# Altium schematic sheet Top Level.SchDoc
size A3; SheetNumber: 1; SheetTotal: 5
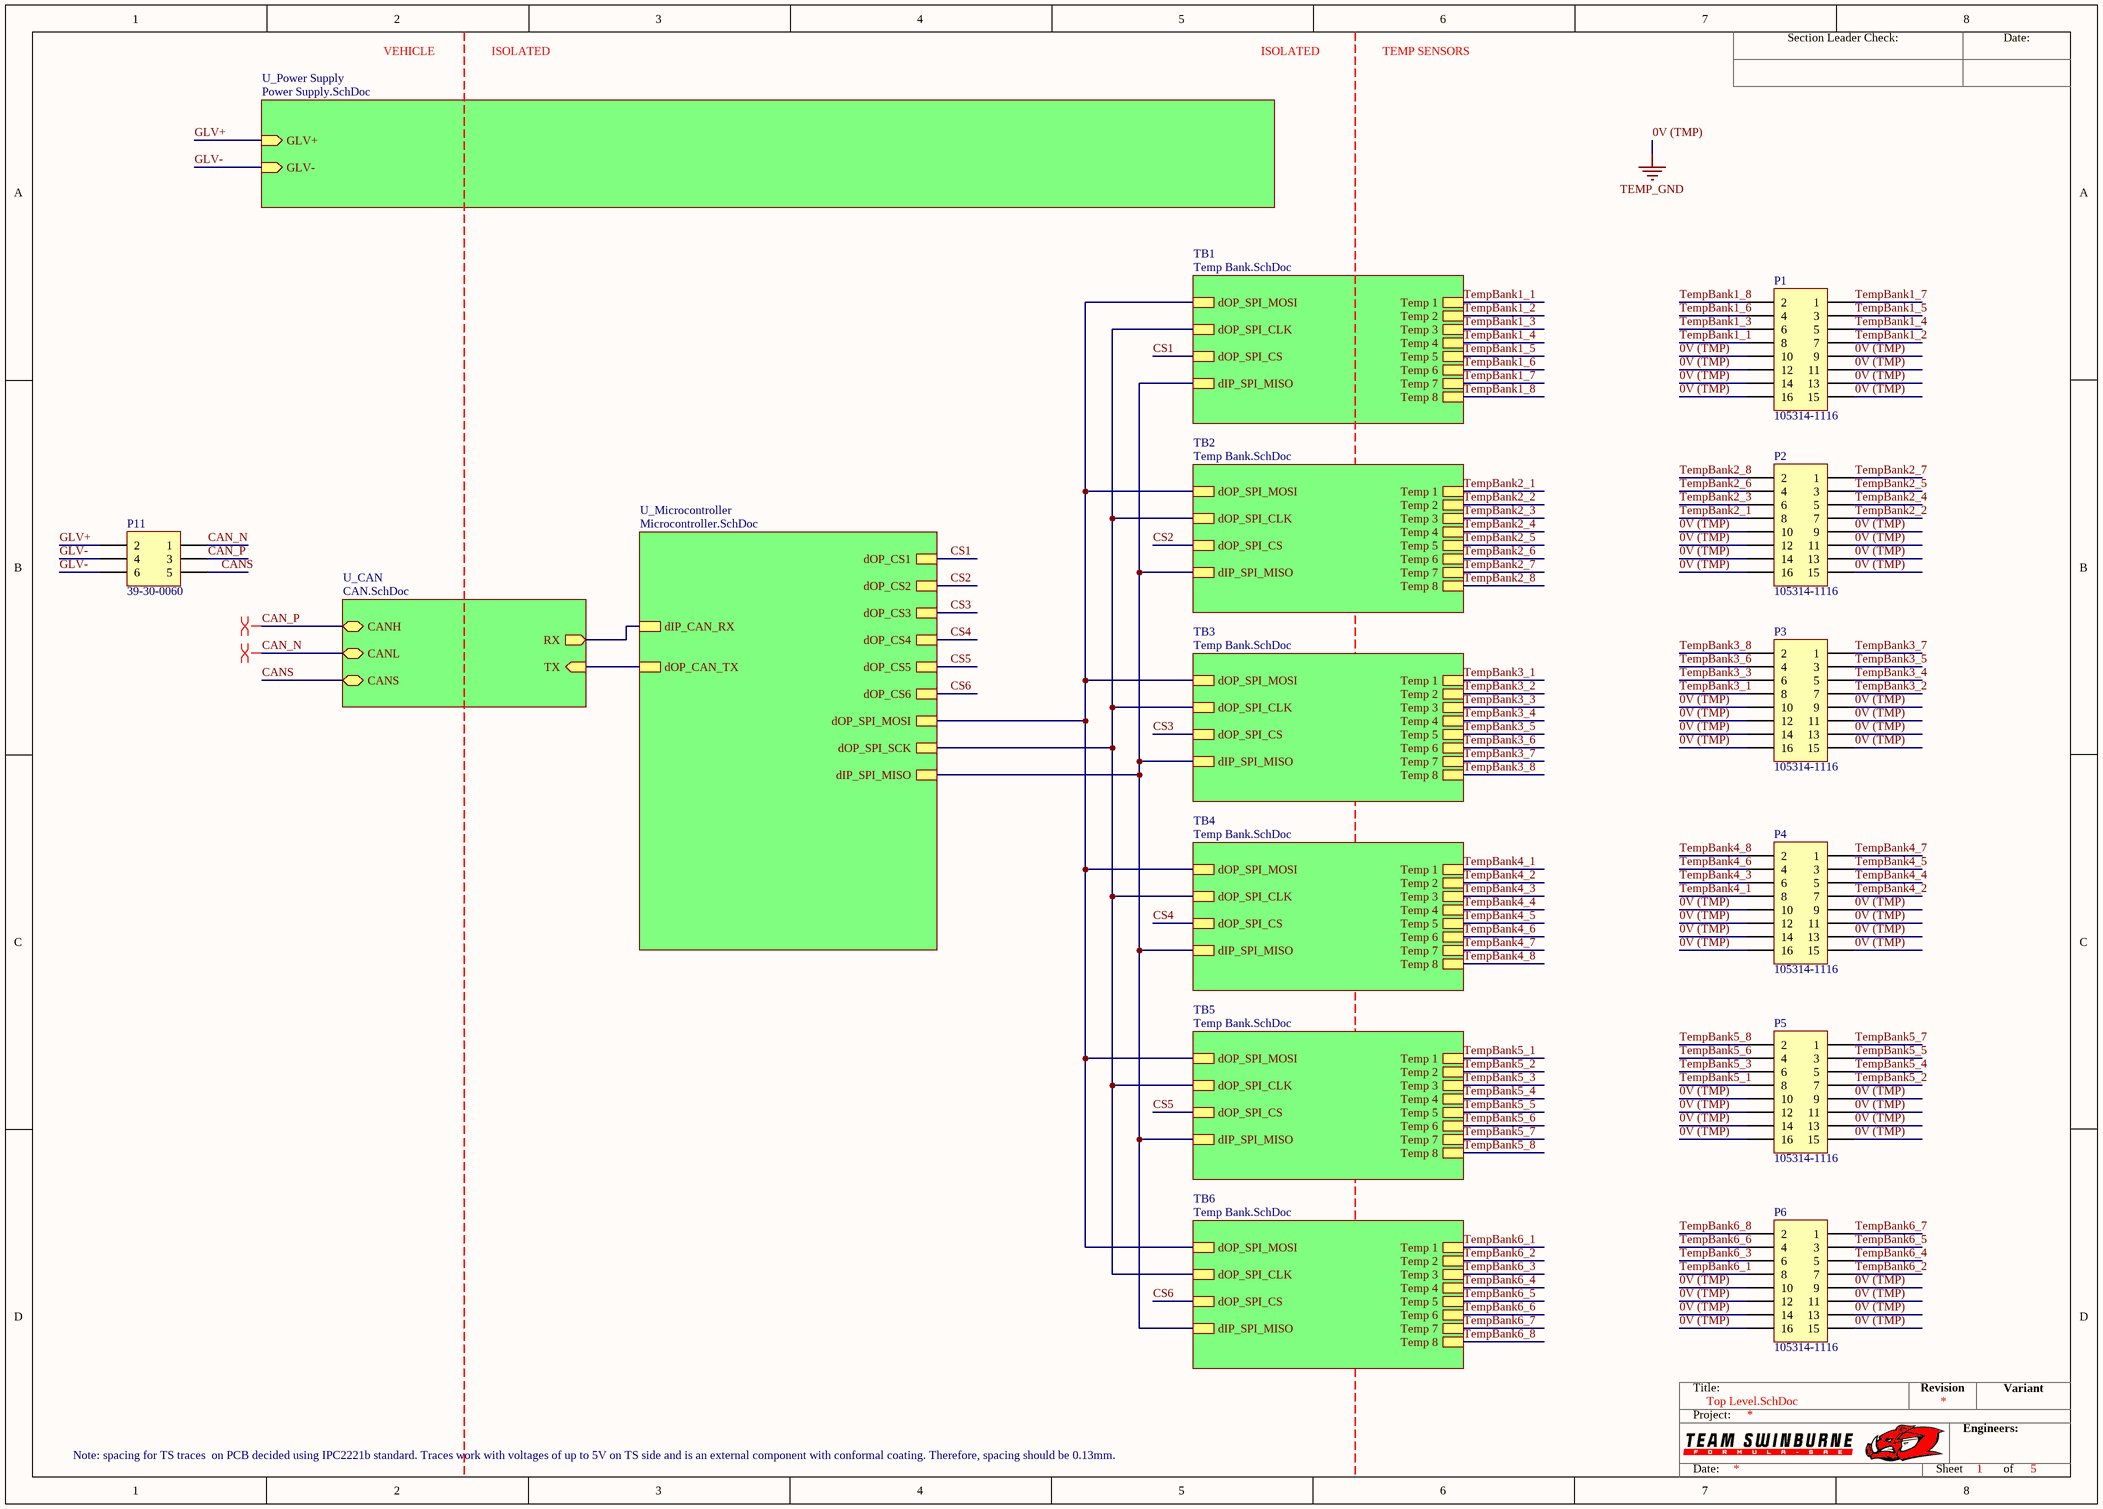
[diagram p0: Top Level.SchDoc]

## Parts
P1  105314-1116  [105314-1116-Footprint-1]
P2  105314-1116  [105314-1116-Footprint-1]
P3  105314-1116  [105314-1116-Footprint-1]
P4  105314-1116  [105314-1116-Footprint-1]
P5  105314-1116  [105314-1116-Footprint-1]
P6  105314-1116  [105314-1116-Footprint-1]
P11  39-30-0060  [39-30-0060-Footprint-1]

## Sub-sheets
TB1 = Temp Bank.SchDoc: dOP_SPI_MOSI, dOP_SPI_CLK, dOP_SPI_CS, dIP_SPI_MISO, Temp 4, Temp 5, Temp 6, Temp 1, Temp 2, Temp 3, Temp 7, Temp 8
TB2 = Temp Bank.SchDoc: dOP_SPI_MOSI, dOP_SPI_CLK, dOP_SPI_CS, dIP_SPI_MISO, Temp 1, Temp 2, Temp 3, Temp 4, Temp 5, Temp 6, Temp 7, Temp 8
TB3 = Temp Bank.SchDoc: dOP_SPI_MOSI, dOP_SPI_CLK, dOP_SPI_CS, dIP_SPI_MISO, Temp 1, Temp 2, Temp 3, Temp 4, Temp 5, Temp 6, Temp 7, Temp 8
TB4 = Temp Bank.SchDoc: dOP_SPI_MOSI, dOP_SPI_CLK, dOP_SPI_CS, dIP_SPI_MISO, Temp 1, Temp 2, Temp 3, Temp 4, Temp 5, Temp 6, Temp 7, Temp 8
TB5 = Temp Bank.SchDoc: dOP_SPI_MOSI, dOP_SPI_CLK, dOP_SPI_CS, dIP_SPI_MISO, Temp 1, Temp 2, Temp 3, Temp 4, Temp 5, Temp 6, Temp 7, Temp 8
TB6 = Temp Bank.SchDoc: dOP_SPI_MOSI, dOP_SPI_CLK, dOP_SPI_CS, dIP_SPI_MISO, Temp 1, Temp 2, Temp 3, Temp 4, Temp 5, Temp 6, Temp 7, Temp 8
U_CAN = CAN.SchDoc: CANH (bidir), RX (out), TX (in), CANL (bidir), CANS (bidir)
U_Microcontroller = Microcontroller.SchDoc: dOP_CS1, dOP_CS2, dOP_CS3, dOP_CS4, dOP_CS5, dOP_SPI_MOSI, dOP_CS6, dOP_SPI_SCK, dIP_CAN_RX, dOP_CAN_TX, dIP_SPI_MISO
U_Power Supply = Power Supply.SchDoc: GLV+ (in), GLV- (in)

## Nets
0V (TMP): P1.9 P1.10 P1.11 P1.12 P1.13 P1.14 P1.15 P1.16 P2.9 P2.10 P2.11 P2.12 P2.13 P2.14 P2.15 P2.16 P3.9 P3.10 P3.11 P3.12 P3.13 P3.14 P3.15 P3.16 P4.9 P4.10 P4.11 P4.12 P4.13 P4.14 P4.15 P4.16 P5.9 P5.10 P5.11 P5.12 P5.13 P5.14 P5.15 P5.16 P6.9 P6.10 P6.11 P6.12 P6.13 P6.14 P6.15 P6.16  [also labelled TEMP_GND]
CAN_N: P11.1 ; sheet U_CAN/CANL
CAN_P: P11.3 ; sheet U_CAN/CANH
CANS: P11.5 ; sheet U_CAN/CANS
CS1: sheet U_Microcontroller/dOP_CS1, sheet TB1/dOP_SPI_CS
CS2: sheet U_Microcontroller/dOP_CS2, sheet TB2/dOP_SPI_CS
CS3: sheet U_Microcontroller/dOP_CS3, sheet TB3/dOP_SPI_CS
CS4: sheet U_Microcontroller/dOP_CS4, sheet TB4/dOP_SPI_CS
CS5: sheet U_Microcontroller/dOP_CS5, sheet TB5/dOP_SPI_CS
CS6: sheet U_Microcontroller/dOP_CS6, sheet TB6/dOP_SPI_CS
GLV+: P11.2 ; sheet U_Power Supply/GLV+
GLV-: P11.4 P11.6 ; sheet U_Power Supply/GLV-
TempBank1_1: P1.8 ; sheet TB1/Temp 1
TempBank1_2: P1.7 ; sheet TB1/Temp 2
TempBank1_3: P1.6 ; sheet TB1/Temp 3
TempBank1_4: P1.5 ; sheet TB1/Temp 4
TempBank1_5: P1.3 ; sheet TB1/Temp 5
TempBank1_6: P1.4 ; sheet TB1/Temp 6
TempBank1_7: P1.1 ; sheet TB1/Temp 7
TempBank1_8: P1.2 ; sheet TB1/Temp 8
TempBank2_1: P2.8 ; sheet TB2/Temp 1
TempBank2_2: P2.7 ; sheet TB2/Temp 2
TempBank2_3: P2.6 ; sheet TB2/Temp 3
TempBank2_4: P2.5 ; sheet TB2/Temp 4
TempBank2_5: P2.3 ; sheet TB2/Temp 5
TempBank2_6: P2.4 ; sheet TB2/Temp 6
TempBank2_7: P2.1 ; sheet TB2/Temp 7
TempBank2_8: P2.2 ; sheet TB2/Temp 8
TempBank3_1: P3.8 ; sheet TB3/Temp 1
TempBank3_2: P3.7 ; sheet TB3/Temp 2
TempBank3_3: P3.6 ; sheet TB3/Temp 3
TempBank3_4: P3.5 ; sheet TB3/Temp 4
TempBank3_5: P3.3 ; sheet TB3/Temp 5
TempBank3_6: P3.4 ; sheet TB3/Temp 6
TempBank3_7: P3.1 ; sheet TB3/Temp 7
TempBank3_8: P3.2 ; sheet TB3/Temp 8
TempBank4_1: P4.8 ; sheet TB4/Temp 1
TempBank4_2: P4.7 ; sheet TB4/Temp 2
TempBank4_3: P4.6 ; sheet TB4/Temp 3
TempBank4_4: P4.5 ; sheet TB4/Temp 4
TempBank4_5: P4.3 ; sheet TB4/Temp 5
TempBank4_6: P4.4 ; sheet TB4/Temp 6
TempBank4_7: P4.1 ; sheet TB4/Temp 7
TempBank4_8: P4.2 ; sheet TB4/Temp 8
TempBank5_1: P5.8 ; sheet TB5/Temp 1
TempBank5_2: P5.7 ; sheet TB5/Temp 2
TempBank5_3: P5.6 ; sheet TB5/Temp 3
TempBank5_4: P5.5 ; sheet TB5/Temp 4
TempBank5_5: P5.3 ; sheet TB5/Temp 5
TempBank5_6: P5.4 ; sheet TB5/Temp 6
TempBank5_7: P5.1 ; sheet TB5/Temp 7
TempBank5_8: P5.2 ; sheet TB5/Temp 8
TempBank6_1: P6.8 ; sheet TB6/Temp 1
TempBank6_2: P6.7 ; sheet TB6/Temp 2
TempBank6_3: P6.6 ; sheet TB6/Temp 3
TempBank6_4: P6.5 ; sheet TB6/Temp 4
TempBank6_5: P6.3 ; sheet TB6/Temp 5
TempBank6_6: P6.4 ; sheet TB6/Temp 6
TempBank6_7: P6.1 ; sheet TB6/Temp 7
TempBank6_8: P6.2 ; sheet TB6/Temp 8
(unnamed): sheet U_CAN/RX, sheet U_Microcontroller/dIP_CAN_RX
(unnamed): sheet U_CAN/TX, sheet U_Microcontroller/dOP_CAN_TX
(unnamed): sheet U_Microcontroller/dOP_SPI_MOSI, sheet TB1/dOP_SPI_MOSI, sheet TB2/dOP_SPI_MOSI, sheet TB3/dOP_SPI_MOSI, sheet TB4/dOP_SPI_MOSI, sheet TB5/dOP_SPI_MOSI, sheet TB6/dOP_SPI_MOSI
(unnamed): sheet U_Microcontroller/dOP_SPI_SCK, sheet TB1/dOP_SPI_CLK, sheet TB2/dOP_SPI_CLK, sheet TB3/dOP_SPI_CLK, sheet TB4/dOP_SPI_CLK, sheet TB5/dOP_SPI_CLK, sheet TB6/dOP_SPI_CLK
(unnamed): sheet U_Microcontroller/dIP_SPI_MISO, sheet TB1/dIP_SPI_MISO, sheet TB2/dIP_SPI_MISO, sheet TB3/dIP_SPI_MISO, sheet TB4/dIP_SPI_MISO, sheet TB5/dIP_SPI_MISO, sheet TB6/dIP_SPI_MISO

## Layout directives
differential pair: CAN_N, CAN_P

## Notes on the sheet
- VEHICLE
- ISOLATED
- TEMP SENSORS
- Note: spacing for TS traces  on PCB decided using IPC2221b standard. Traces work with voltages of up to 5V on TS side and is an external component with conformal coating. Therefore, spacing should be 0.13mm.
- Section Leader Check:
- Date:
- Title:
- Revision
- Variant
- Project:
- Engineers:
- Sheet
- of

## Library data of the parts
P1-P6 = CMP-104-000033-1: Conn Wire to Board HDR 16 POS 2.5mm Solder RA Side Entry Thru-Hole Tray
P11 = CMP-104-000019-1: Rectangular Power Connector, 6 Contact(s), Male, Solder Terminal, Plug; Option: General Purpose; Reference Standard: UL; Mixed Contacts: No; Plating Thickness: 100uin; Body Length: 0.54inch; Dielectric Withstanding Voltage (AC): 1.5kV; Number of Contacts: 6; Mounting Option 1: FRICTION RAMP; Board Mounting Option: PEG; Contact Resistance: 10mR; Insulation Resistance: 1GR; Durability: 30Cycles; Mounting Option 2: LOCKING; Mating Information: MULTIPLE MATING PARTS AVAILABLE; Throw Configuration: S0P6; Number Of Connectors: 1; Body Breadth: 0.38inch; Reliability: COMMERCIAL; Contact Style: SQ PIN-SKT; Body Depth: 0.764inch; Connector Type: Power,Rectangular; Max Operating Temperature: 105°C; Shell Material: POLYAMIDE66; Contact Finish - Termination: Tin (Sn) - with Nickel (Ni) barrier; Flammability Rating: UL94 V-0; JESD-609 Code: e3; Contact Finish - Mating: TIN (200) OVER COPPER; Filter Feature: No; Mounting Technology: Board; Termination: Solder; Mounting Style: RIGHT ANGLE; Terminal Length: 0.14inch; IEC Conformance: No; Empty Shell: No; Contact Gender: Male; DIN Conformance: No; Min Operating Temperature: -40°C; Insulation Color: Natural; Contact Material: Brass; Reach SVHC Compliant: Yes; RoHS Compliant: Yes; Insulation Material: Nylon; MIL Conformance: No; Body/Shell Style: PLUG